# EAGLE design MO1 (EAGLE 7.4.0)
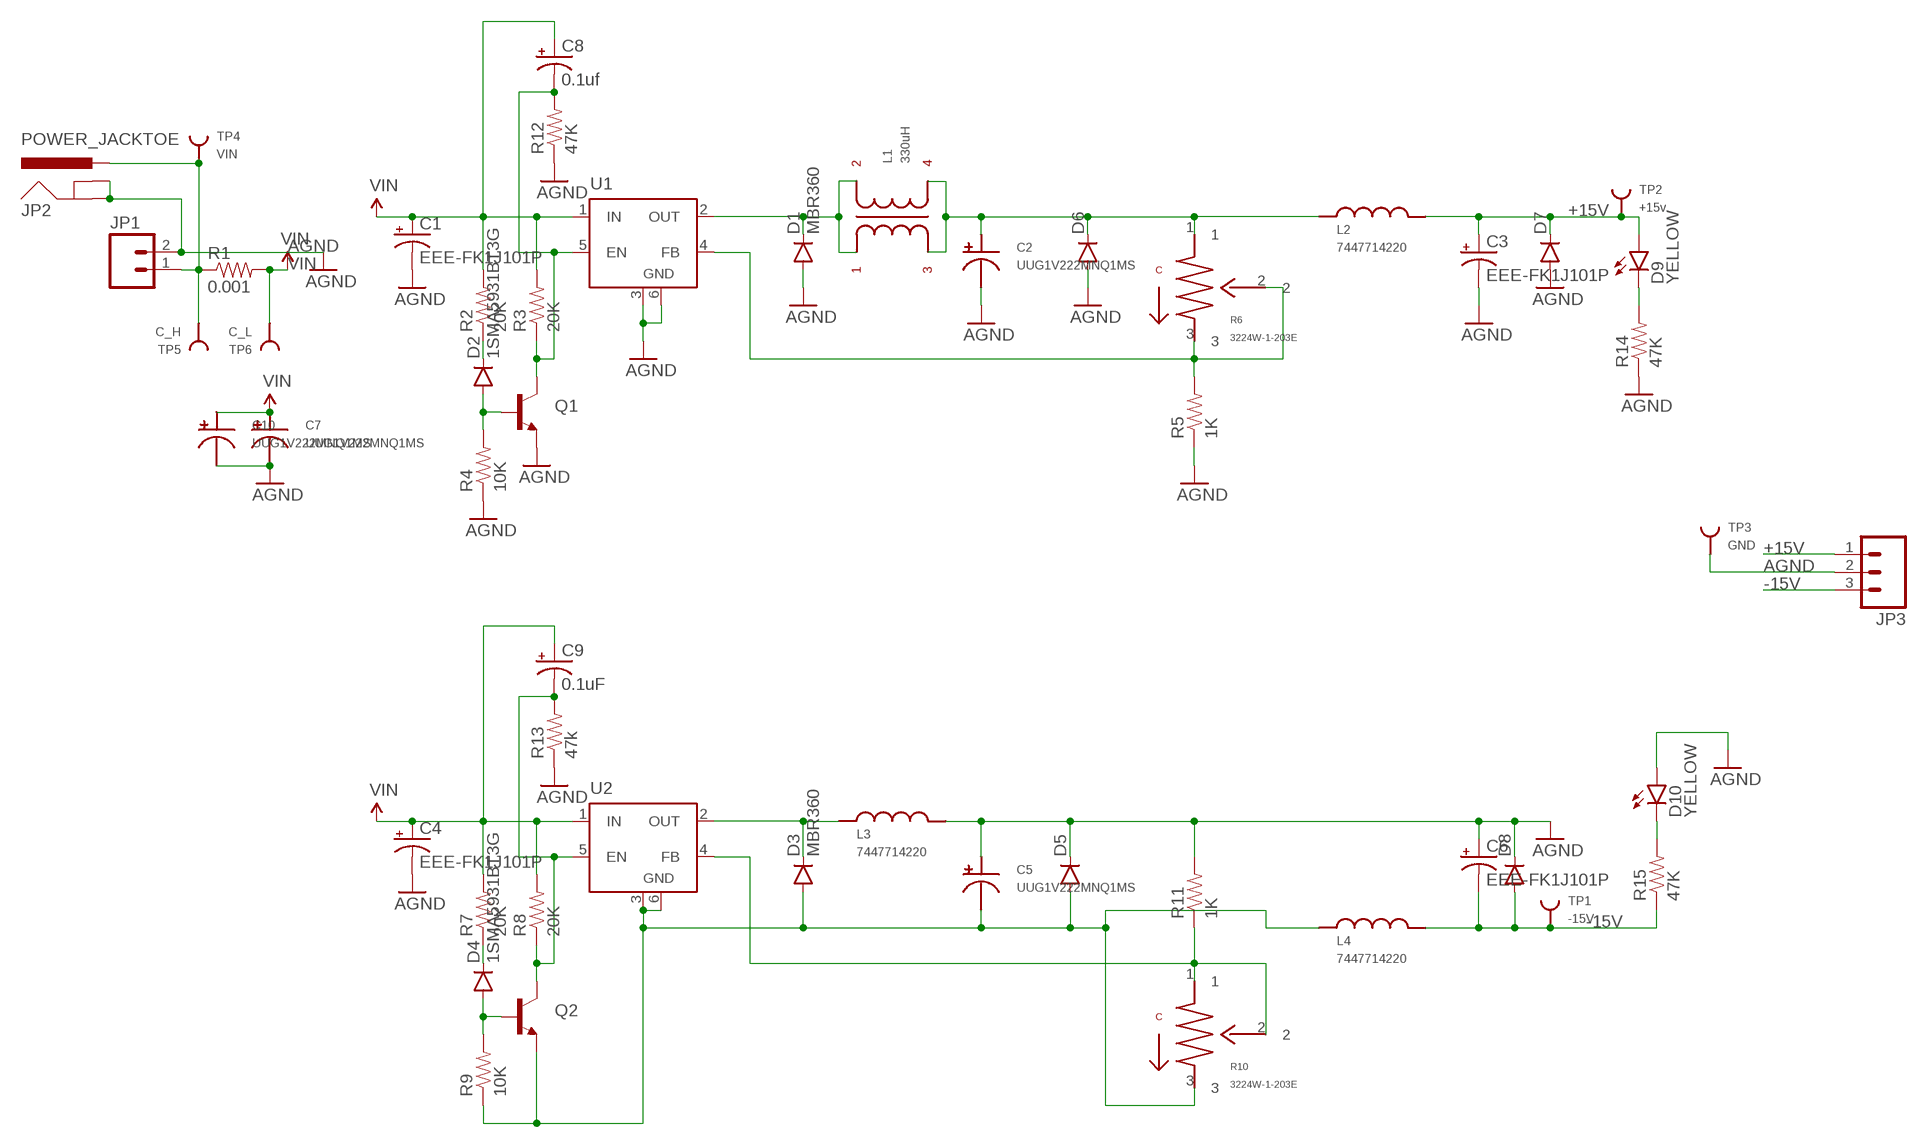
[diagram p0: schematic, sheet 1]

## Parts
C1  EEE-FK1J101P  CAP_POLG  [PANASONIC_G]
C2  UUG1V222MNQ1MS  [POL_18X21.5]
C3  EEE-FK1J101P  CAP_POLG  [PANASONIC_G]
C4  EEE-FK1J101P  CAP_POLG  [PANASONIC_G]
C5  UUG1V222MNQ1MS  [POL_18X21.5]
C6  EEE-FK1J101P  CAP_POLG  [PANASONIC_G]
C7  UUG1V222MNQ1MS  [POL_18X21.5]
C8  0.1uf  CAP_POLC  [PANASONIC_C]
C9  0.1uF  CAP_POLC  [PANASONIC_C]
C10  UUG1V222MNQ1MS  [POL_18X21.5]
D1  MBR360  DIODESMB  [SMB-DIODE]
D2  1SMA5931BT3G  DIODESMA  [SMA-DIODE]
D3  MBR360  DIODESMB  [SMB-DIODE]
D4  1SMA5931BT3G  DIODESMA  [SMA-DIODE]
D5  DIODESMA  [SMA-DIODE]
D6  DIODESMA  [SMA-DIODE]
D7  DIODESMA  [SMA-DIODE]
D8  DIODESMA  [SMA-DIODE]
D9  YELLOW  LED-YELLOW1206  [LED-1206]
D10  YELLOW  LED-YELLOW1206  [LED-1206]
JP1  M023.5MM_LOCK  [SCREWTERMINAL-3.5MM-2_LOCK]
JP2  POWER_JACKTOE  [POWER_JACK_SMD_OVERPASTE_TOE]
JP3  M03SCREW_LOCK  [SCREWTERMINAL-3.5MM-3_LOCK.007S]
L1  330uH  DRQ127-331-R  [DRQ127]
L2  7447714220  [INDUCTOR_10X10]
L3  7447714220  [INDUCTOR_10X10]
L4  7447714220  [INDUCTOR_10X10]
Q1  TRANSISTOR_NPNSOT23-3  [SOT23-3]
Q2  TRANSISTOR_NPNSOT23-3  [SOT23-3]
R1  0.001  0.001OHM-3W-1%(2512)3W/1%  [2512]
R2  20K  1.8KOHM1/10W1%(0603)  [0603-RES]
R3  20K  1.8KOHM1/10W1%(0603)  [0603-RES]
R4  10K  1.8KOHM1/10W1%(0603)  [0603-RES]
R5  1K  0.75OHM-1/4W-1%(0805)  [0805]
R6  3224W-1-203E  [3224W]
R7  20K  1.8KOHM1/10W1%(0603)  [0603-RES]
R8  20K  1.8KOHM1/10W1%(0603)  [0603-RES]
R9  10K  1.8KOHM1/10W1%(0603)  [0603-RES]
R10  3224W-1-203E  [3224W]
R11  1K  0.75OHM-1/4W-1%(0805)  [0805]
R12  47K  1.8KOHM1/10W1%(0603)  [0603-RES]
R13  47k  1.8KOHM1/10W1%(0603)  [0603-RES]
R14  47K  1.8KOHM1/10W1%(0603)  [0603-RES]
R15  47K  1.8KOHM1/10W1%(0603)  [0603-RES]
TP1  -15V  TP  [TP]
TP2  +15v  TP  [TP]
TP3  GND  TP  [TP]
TP4  VIN  TP  [TP]
TP5  C_H  TP  [TP]
TP6  C_L  TP  [TP]
U1  LM2596S  [TO263-5]
U2  LM2596S  [TO263-5]

## Nets
+15V: C3.+ D7.C D9.A JP3.1 L2.2 TP2.P$1(TP)
-15V: C6.- D8.A JP3.3 L4.2 R15.1 TP1.P$1(TP)
AGND: C1.- C2.NEGATIVE C3.- C4.- C5.POSITIVE C6.+ C7.NEGATIVE C10.NEGATIVE D1.A D5.C D6.A D7.A D8.C D10.A JP1.2 JP2.GND(GNDBREAK) JP2.P$4(GND) JP3.2 L3.2 Q1.2(E) R4.1 R5.1 R11.2 R12.1 R13.1 R14.1 TP3.P$1(TP) U1.3(GND) U1.6(GND)
N$1: JP1.1 JP2.VIN0(PWR) R1.1 TP4.P$1(TP) TP5.P$1(TP)
N$2: C2.POSITIVE D6.C L1.3 L1.4 L2.1 R6.1
N$3: D1.C L1.1 L1.2 U1.2(OUT)
N$4: D2.C R2.1
N$5: D2.A Q1.1(B) R4.2
N$6: D9.C R14.2
N$7: R5.2 R6.2 R6.3 U1.4(FB)
N$8: D3.C L3.1 U2.2(OUT)
N$9: C5.NEGATIVE D3.A D5.A L4.1 Q2.2(E) R9.1 R10.3 U2.3(GND) U2.6(GND)
N$10: D4.C R7.1
N$11: D4.A Q2.1(B) R9.2
N$12: D10.C R15.2
N$14: R10.1 R10.2 R11.1 U2.4(FB)
N$15: C8.- Q1.3(C) R3.1 R12.2 U1.5(EN)
N$16: C9.- Q2.3(C) R8.1 R13.2 U2.5(EN)
VIN: C1.+ C4.+ C7.POSITIVE C8.+ C9.+ C10.POSITIVE R1.2 R2.2 R3.2 R7.2 R8.2 TP6.P$1(TP) U1.1(IN) U2.1(IN)

## Library data of the parts
C1 C3 C4 C6 C8 C9 = SparkFun-Capacitors:CAP_POL: Capacitor Polarized These are standard SMD and PTH capacitors. Normally 10uF, 47uF, and 100uF in electrolytic and tantalum varieties. Always verify the external diameter of the through hole cap, it varies with capacity, voltage, and manufacturer. The EIA devices should be standard.
C2 C5 C7 C10 = MO1:UUG1V222MNQ1MS
D1 D3 = SparkFun-DiscreteSemi:DIODE: Diode These are standard reverse protection diodes and small signal diodes. SMA package can handle up to about 1A. SOD-323 can handle about 200mA. What the SOD-323 package when ordering, there are some mfgs out there that are 5-pin packages.; PROD_ID: DIO-09646
D2 D4-D8 = SparkFun-DiscreteSemi:DIODE: Diode These are standard reverse protection diodes and small signal diodes. SMA package can handle up to about 1A. SOD-323 can handle about 200mA. What the SOD-323 package when ordering, there are some mfgs out there that are 5-pin packages.
D9 D10 = SparkFun-LED:LED-YELLOW: Yellow SMD LEDs LilyPad 1206- DIO-09909 0603- DIO-09003 "SMART" means more efficient and expensive; PROD_ID: DIO-00820
JP1 = SparkFun-Connectors:M02: Standard 2-pin 0.1" header. Use with - straight break away headers ( PRT-00116) - right angle break away headers (PRT-00553) - swiss pins (PRT-00743) - machine pins (PRT-00117) - female headers (PRT-00115) Molex polarized connector foot print use with: PRT-08233 with associated crimp pins and housings. 2.54_SCREWTERM for use with PRT-10571. 3.5mm Screw Terminal footprints for PRT-08084 5mm Screw Terminal footprints for use with PRT-08432; PROD_ID: CONN-08399
JP2 = SparkFun-Connectors:POWER_JACK: Power Jack This is the standard 5.5mm barrel jack for power. The PTH is the most common, proven, reliable, footprint. The Slot footprint only works if the mill layer is transmitted to the PCB fab house so be warned. Mating wall wart : TOL-00298 (and others); PROD_ID: CONN-08106; SF_ID: PRT-12748
JP3 = SparkFun-Connectors:M03: Header 3 Standard 3-pin 0.1" header. Use with straight break away headers (SKU : PRT-00116), right angle break away headers (PRT-00553), swiss pins (PRT-00743), machine pins (PRT-00117), and female headers (PRT-00115). Molex polarized connector foot print use with SKU : PRT-08232 with associated crimp pins and housings.; PROD_ID: CONN-08288
L1 = MO1:DRQ127-331-R
L2-L4 = MO1:7447714220
Q1 Q2 = SparkFun-DiscreteSemi:TRANSISTOR_NPN: Generic NPN BJT MMBT2222A - TRANS-08049 (SOT-23, 1A 40V) MPSA42 - TRANS-09116 (SOT-23, 500mA 300V) MMBT5088LT1G - TRANS-11160 (SOT-23, 50 mA 30V) BC547 - COM-08928 <http://www.sparkfun.com/products/8928> (TO-92 45V 100mA) (1.Collector 2.Base 3.Emitter) 2N3904 - COM-00521 <http://www.sparkfun.com/products/521> (TO-92 40V 200mA) (1.Emitter 2.Base 3.Collector) P2N2222A - COM-12852 <http://www.sparkfun.com/products/12852> (TO-92 40V 600mA) (1.Collector 2.Base 3.Emitter); PROD_ID: TRANS-08049
R1 = SparkFun-Resistors:0.001OHM-3W-1%(2512); PROD_ID: RES-12449
R2-R4 R7-R9 R12-R15 = SparkFun-Resistors:1.8KOHM1/10W1%(0603): RES-09119; PROD_ID: RES-09119; VALUE: 1.8k
R5 R11 = SparkFun-Resistors:0.75OHM-1/4W-1%(0805): RES-08474; PROD_ID: RES-08474; VALUE: 0.75
R6 R10 = MO1:3224W-1-203E
TP1-TP6 = MO1:TP
U1 U2 = linear:LM2596S: STEP-DOWN VOLTAGE REGULATOR

## Board
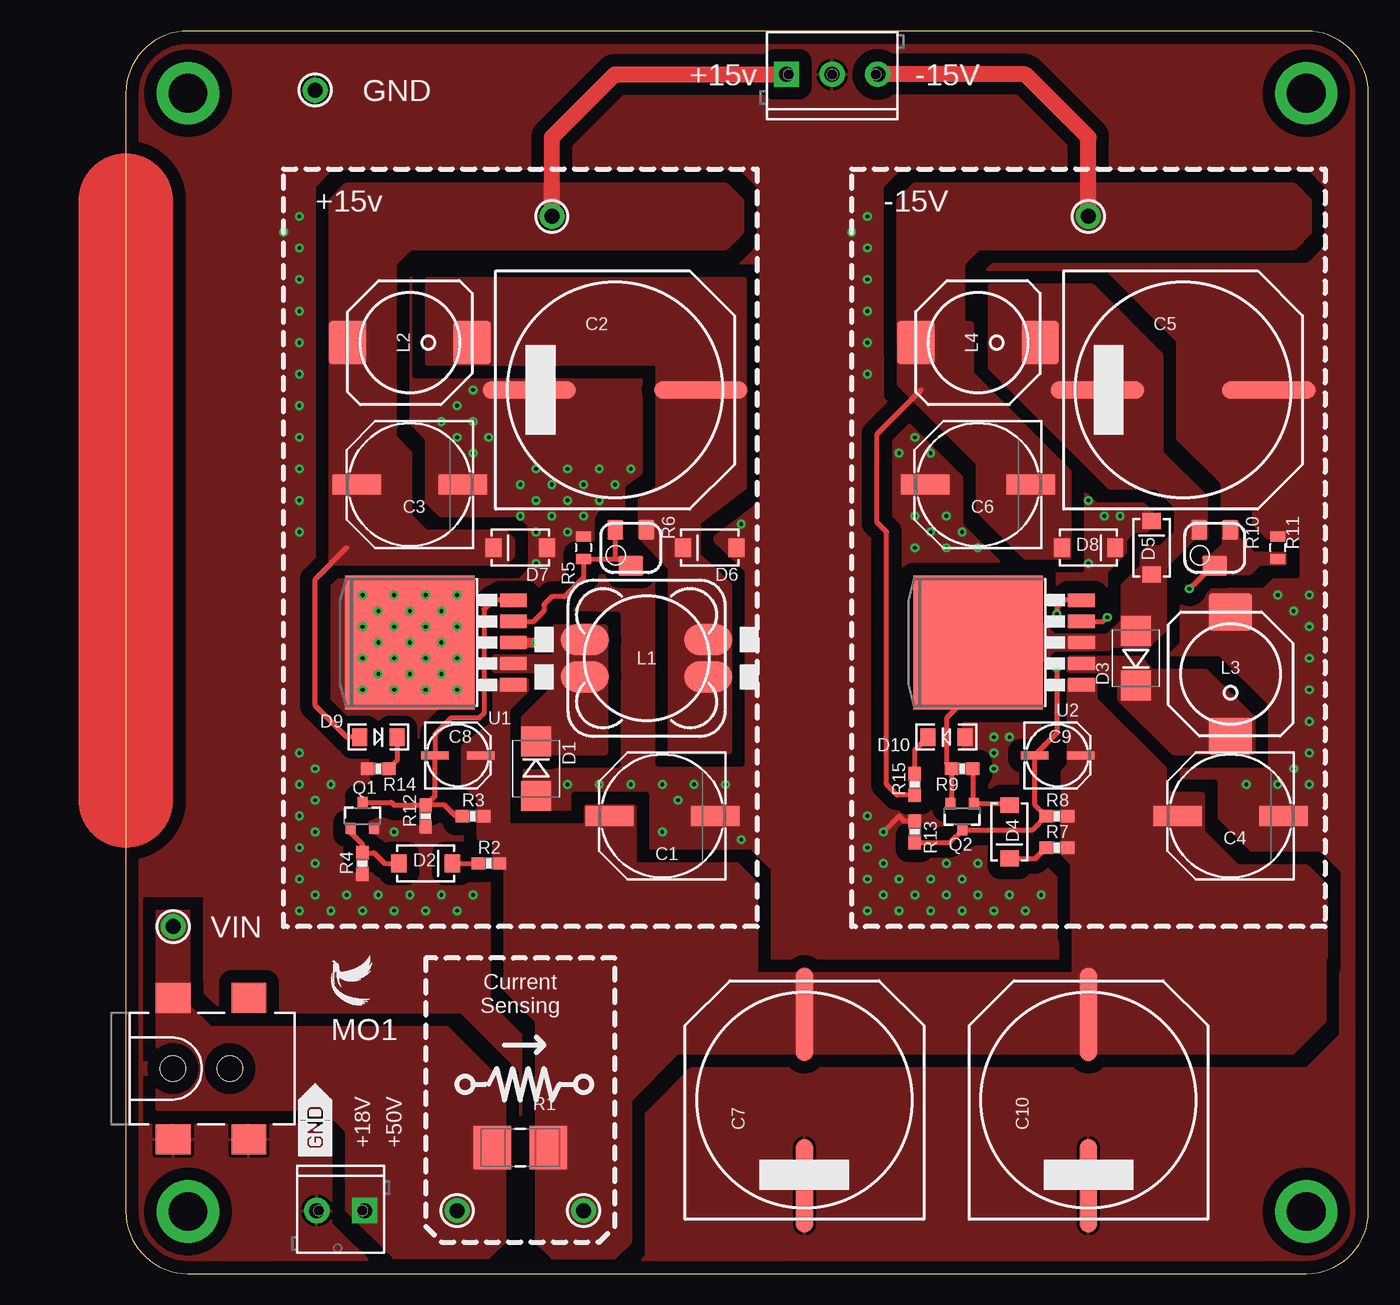
[diagram p1: board, top side]
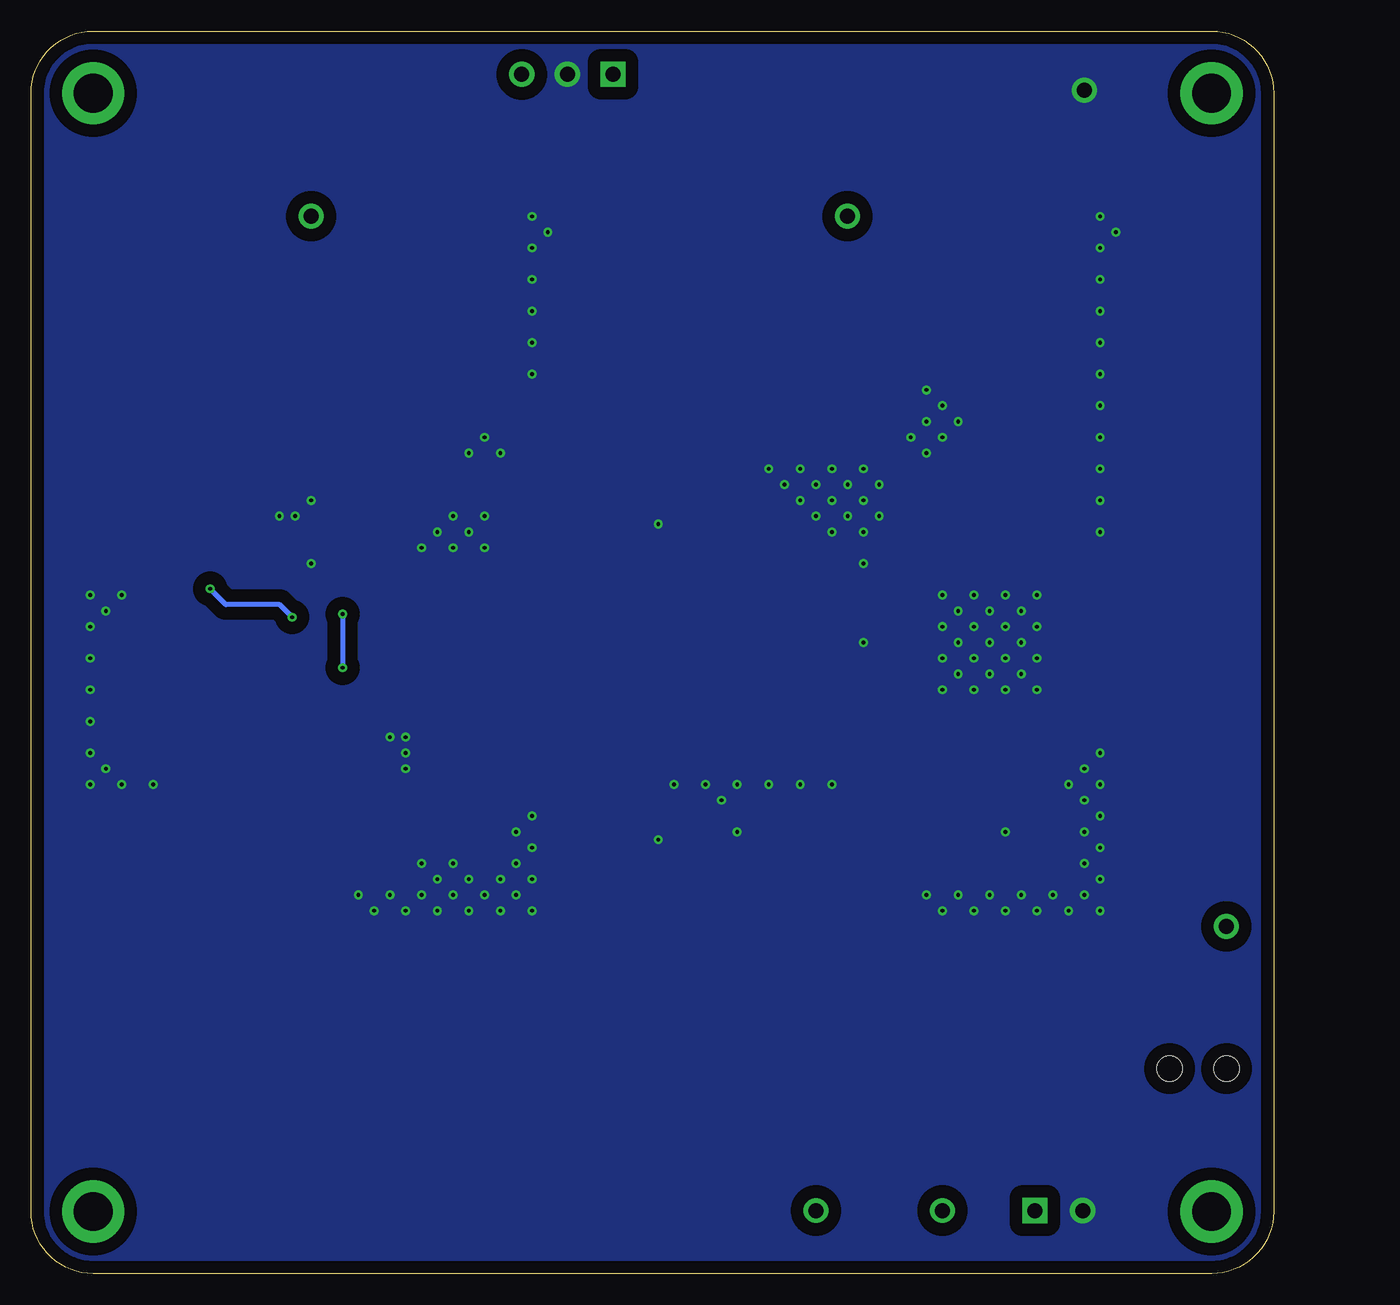
[diagram p2: board, bottom side, seen from below]

Size 100 x 100 mm. Coordinates in mm from the lower left corner, seen from the top.
Outline: 0,95 0,5 arc90 5,0 95,0 arc90 100,5 100,95 arc90 95,100 5,100 arc90 0,95
Copper layers (1*16): Top 0.035mm / dielectric 1.5mm / Bottom 0.035mm
Design rules "default *": minimum track width 8mil, minimum drill 12mil, track to track 6mil, track to pad 6mil, pad to pad 6mil, via to via 6mil, smd to smd 6mil, copper to edge 40mil, drill to drill 8mil, minimum pad ring 10mil, minimum via ring 8mil, stop-mask expansion 4mil, vias tented up to drill 24mil, thermal gap 10mil

### Footprints (pad centres in the part's own frame; a part is rotated, then mirrored left to right if it is on the bottom)
PANASONIC_G = smd 3.9 x 1.6: + 4.25,0; - -4.25,0
POL_18X21.5 = smd 1.4 x 7.5: NEGATIVE 0,-6.9; POSITIVE 0,6.9
PANASONIC_C = smd 2.2 x 0.65: + 1.9,-0.2; - -1.8,-0.2
SMB-DIODE = smd 2.4 x 2.4: A 2.2,0; C -2.2,0
SMA-DIODE = smd 1.27 x 1.47: A -2.15,0; C 2.15,0
LED-1206 = smd 1.2 x 1.4: A -1.5,0; C 1.5,0
SCREWTERMINAL-3.5MM-2_LOCK = drill 1.2 pad 2.032 square: 1 -0.178,0 | drill 1.2 pad 2.032: 2 3.678,0
POWER_JACK_SMD_OVERPASTE_TOE = smd 2.8 x 2.4: GND 0,-5.7; P$4 6.1,-5.7; VIN0 0,5.7; VIN1 6.1,5.7 | hole 2.032: 0,0; 4.572,0
SCREWTERMINAL-3.5MM-3_LOCK.007S = drill 1.2 pad 2.032 square: 1 -0.178,0 | drill 1.2 pad 2.032: 2 3.5,0; 3 7.178,0
DRQ127 = smd 3.85 x 2.5: 1 -4.975,1.5; 2 -4.975,-1.5; 3 4.975,-1.5; 4 4.975,1.5
INDUCTOR_10X10 = smd 3.5 x 3: 1 0,5; 2 0,-5
SOT23-3 = smd 0.8 x 0.9: 1 -0.95,-1; 2 0.95,-1; 3 0,1.1
2512 = smd 3 x 3.5: 1 -2.25,0; 2 2.25,0
0603-RES = smd 1.1 x 1: 1 -0.85,0; 2 0.85,0
0805 = smd 0.8 x 1.2: 1 -0.9,0; 2 0.9,0
3224W = smd 1.6 x 1.3: 1 -1.45,1.25; 3 -1.45,-1.25 | smd 1.6 x 2: 2 1.45,0
TP = drill 1.2 pad 2: P$1 0,0
TO263-5 = smd 1.067 x 2.159: 1 -3.404,-5.791; 2 -1.702,-5.791; 3 0,-5.791; 4 1.702,-5.791; 5 3.404,-5.791 | smd 10.8 x 10.41: 6 0,2.54

### Placement (x,y rotation side)
C1  43.18,36.83 180 top
C2  39.37,71.12 270 top
C3  22.86,63.5 180 top
C4  88.9,36.83 180 top
C5  85.09,71.12 270 top
C6  68.58,63.5 180 top
C7  54.61,13.97 0 top
C8  26.67,41.91 0 top
C9  74.93,41.91 0 top
C10  77.47,13.97 0 top
D1  33.02,40.64 270 top
D2  24.13,33.02 0 top
D3  81.28,49.53 90 top
D4  71.12,35.56 270 top
D5  82.55,58.42 90 top
D6  46.99,58.42 180 top
D7  31.75,58.42 180 top
D8  77.47,58.42 0 top
D9  20.32,43.18 0 top
D10  66.04,43.18 180 top
JP1  19.05,5.08 180 top
JP2  3.81,16.51 0 top
JP3  53.34,96.52 0 top
L1  41.91,49.53 0 top
L2  22.86,74.93 270 top
L3  88.9,48.26 180 top
L4  68.58,74.93 270 top
Q1  19.05,36.83 0 top
Q2  67.31,36.83 180 top
R1  31.75,10.16 0 top
R2  29.21,33.02 0 top
R3  27.94,36.83 0 top
R4  19.05,33.02 90 top
R5  36.83,58.42 270 top
R6  40.64,58.42 270 top
R7  74.93,34.29 0 top
R8  74.93,36.83 0 top
R9  67.31,40.64 0 top
R10  87.63,58.42 270 top
R11  92.71,58.42 90 top
R12  24.13,36.83 90 top
R13  63.5,35.56 270 top
R14  20.32,40.64 0 top
R15  63.5,39.37 90 top
TP1  77.47,85.09 0 top
TP2  34.29,85.09 0 top
TP3  15.24,95.25 0 top
TP4  3.81,27.94 0 top
TP5  26.67,5.08 0 top
TP6  36.83,5.08 0 top
U1  25.4,50.8 90 top
U2  71.12,50.8 90 top
U$19  [LOGO]  16.51,21.59 0 top

### Tracks (layer width: path | path; a pad name or v marks a point on that pad's centre or on a via)
+15V
  Top 0.406: D9.A 17.78,43.18 15.24,45.72 15.24,55.88 17.78,58.42
  Top 1.27: TP2.P$1 34.29,91.44 39.37,96.52 JP3.1
  pour Top (no thermals): 16.51,80.01 21.59,80.01 21.59,67.31 22.86,66.04 22.86,60.96 24.13,59.69 30.48,59.69 31.11,59.05 31.11,57.78 30.48,57.15 16.51,57.15
  pour Top: 16.51,80.01 16.51,86.36 17.78,87.63 48.26,87.63 49.53,86.36 49.53,83.82 48.26,82.55 22.86,82.55 21.59,81.28 21.59,80.01
-15V
  Top 0.406: R15.1 62.06,38.52 61.21,39.37 61.21,59.69 60.45,60.45 60.45,67.56 64.01,71.12
  Top 1.27: TP1.P$1 77.47,91.44 72.39,96.52 JP3.3
  pour Top (no thermals): 62.23,76.45 62.23,71.63 68.58,65.28 68.58,61.47 72.39,57.66 75.95,57.66 75.95,64.52 68.07,72.39 68.07,76.45
  pour Top (no thermals): 62.23,74.93 62.23,86.36 63.5,87.63 93.98,87.63 95.25,86.36 95.25,83.82 93.98,82.55 68.58,82.55 67.31,81.28 67.31,74.93
AGND  (via drill 0.3)
  Top 0.406: R13.1 62.65,36.41 62.23,36.83 v60.96,35.56
  Top 0.813: U1.3 v33.02,50.8
  other vias: 13.97,85.09 12.7,83.82 13.97,82.55 59.69,82.55 59.69,85.09 58.42,83.82 59.69,80.01 59.69,77.47 59.69,74.93 59.69,72.39 13.97,80.01 13.97,77.47 13.97,74.93 13.97,72.39 13.97,69.85 13.97,67.31 13.97,64.77 13.97,62.23 13.97,59.69 19.05,54.61 20.32,53.34 21.59,54.61 24.13,54.61 26.67,54.61 25.4,53.34 22.86,53.34 19.05,52.07 21.59,52.07 24.13,52.07 26.67,52.07 13.97,41.91 13.97,39.37 15.24,40.64 16.51,39.37 15.24,38.1 13.97,36.83 15.24,35.56 13.97,34.29 15.24,33.02 13.97,31.75 15.24,30.48 13.97,29.21 16.51,29.21 19.05,29.21 21.59,29.21 24.13,29.21 26.67,29.21 17.78,30.48 20.32,30.48 22.86,30.48 25.4,30.48 27.94,30.48 21.59,35.56 20.32,50.8 25.4,50.8 22.86,50.8 19.05,49.53 20.32,48.26 21.59,49.53 24.13,49.53 26.67,49.53 25.4,48.26 22.86,48.26 19.05,46.99 21.59,46.99 24.13,46.99 26.67,46.99 35.56,59.69 34.29,60.96 33.02,59.69 36.83,60.96 35.56,62.23 38.1,62.23 39.37,63.5 40.64,64.77 38.1,64.77 35.56,64.77 33.02,64.77 36.83,63.5 34.29,63.5 33.02,62.23 31.75,63.5 31.75,60.96 33.02,57.15 27.94,71.12 26.67,69.85 27.94,68.58 26.67,67.31 27.94,66.04 25.4,68.58 29.21,67.31 35.56,39.37 38.1,39.37 40.64,39.37 43.18,39.37 45.72,39.37 48.26,39.37 44.45,38.1 43.18,35.56 49.53,34.92 49.53,60.33 63.5,67.31 62.23,66.04 64.77,66.04 63.5,60.96 63.5,58.42 64.77,59.69 66.04,60.96 67.31,59.69 66.04,58.42 68.58,58.42 77.47,62.23 78.74,60.96 77.47,57.15 80.01,60.96 92.71,54.61 95.25,54.61 93.98,53.34 95.25,52.07 95.25,49.53 95.25,46.99 95.25,44.45 95.25,41.91 95.25,39.37 93.98,40.64 92.71,39.37 90.17,39.37 62.23,29.21 59.69,29.21 64.77,29.21 67.31,29.21 69.85,29.21 72.39,29.21 60.96,30.48 63.5,30.48 66.04,30.48 68.58,30.48 71.12,30.48 73.66,30.48 59.69,31.75 62.23,31.75 64.77,31.75 67.31,31.75 68.58,33.02 66.04,33.02 60.96,33.02 59.69,34.29 59.69,36.83 69.85,43.18 71.12,43.18 69.85,41.91 69.85,40.64
  pour Top (isolate 1.016, rank 2, no thermals): 12.7,86.36 50.8,86.36 50.8,27.94 12.7,27.94 12.7,81.28 10.16,81.28 10.16,83.82 12.7,83.82
  pour Bottom (isolate 1.016, rank 2, no thermals): 10.16,86.36 50.8,86.36 50.8,27.94 12.7,27.94 12.7,83.82 10.16,83.82
  pour Top (isolate 1.016, rank 2, no thermals): 55.88,83.82 58.42,83.82 58.42,86.36 96.52,86.36 96.52,27.94 58.42,27.94 58.42,81.28 55.88,81.28
  pour Bottom (isolate 1.016, rank 2, no thermals): 55.88,86.36 96.52,86.36 96.52,27.94 58.42,27.94 58.42,83.82 55.88,83.82
  pour Top (isolate 1.016, rank 6): -7.62,101.6 101.6,101.6 101.6,-2.54 -2.54,-2.54 -2.54,96.52 -7.62,96.52
  pour Bottom (isolate 1.016, rank 6, no thermals): -7.62,96.52 -2.54,96.52 -2.54,101.6 101.6,101.6 101.6,-2.54 -2.54,-2.54 -2.54,91.44 -7.62,91.44
N$1
  pour Top (rank 2, no thermals): 2.54,29.21 5.08,29.21 5.08,21.59 6.86,19.81 25.91,19.81 30.48,15.24 30.48,2.54 29.21,1.27 21.59,1.27 17.78,5.08 17.78,11.43 16,13.21 2.54,13.21
N$2
  pour Top (no thermals): 24.26,73.28 42.8,73.28 42.8,63.25 41.4,62.23 41.4,59.31 43.81,56.77 43.81,42.04 48.64,42.04 48.64,55.37 46.1,57.78 46.1,60.45 49.78,63.25 49.78,80.01 24.26,80.01
N$3
  pour Top (no thermals): 29.72,49.66 34.54,49.66 34.54,52.07 38.61,52.07 38.61,41.91 32,41.91 32,44.7 34.54,47.24 34.54,48.51 29.72,48.51
N$4
  Top 0.406: D2.C R2.1
N$5
  Top 0.406: Q1.1 18.1,35.49 19.05,34.54 R4.2 19.98,33.87 20.83,33.02 D2.A
N$6
  Top 0.406: D9.C 21.82,41.29 R14.2
N$7
  Top 0.406: 39.5,57.52 R5.2 36.83,56.01 35.31,54.48 34.29,54.48 33.66,53.85 33.66,53.34 32.77,52.45 31.24,52.45 U1.4 | 39.5,57.52 40.09,57.52 R6.2 | R6.3 39.39,57.63 39.5,57.52
N$8
  pour Top (no thermals): 75.95,49.53 81.53,49.53 82.55,48.51 86.87,48.51 90.68,44.7 90.68,41.91 84.33,41.91 80.01,46.23 80.01,47.24 78.74,48.51 75.95,48.51
N$9
  Top 0.406: U2.6 68.58,47.24 66.04,44.7 66.04,41.06 R9.1 66.46,37.93 Q2.2
  pour Top (no thermals): 69.6,79.5 77.72,79.5 83.31,73.91 83.31,66.04 86.87,62.48 86.87,59.18 85.85,59.18 83.57,56.9 83.57,51.82 82.3,50.55 79.25,50.55 78.99,50.29 75.95,50.29 75.95,51.31 78.99,51.31 80.26,52.58 80.26,52.83 80.26,55.37 81.79,56.9 81.79,57.91 82.3,58.42 83.31,58.42 84.58,59.69 84.58,61.72 83.06,63.25 79.25,63.25 69.6,72.9
  pour Top (no thermals): 77.72,51.31 74.68,51.31 73.66,52.32 73.66,49.28 74.68,50.29 77.72,50.29
N$10
  Top 0.406: D4.C 73.2,33.41 R7.1
N$11
  Top 0.406: R9.2 68.16,37.93 Q2.1 71,37.83 D4.A
N$12
  Top 0.406: R15.2 63.5,42.14 D10.C
N$13  (via drill 3.1 pad 5)
  other vias: 5,95
N$14  (via drill 0.3)
  Top 0.406: U2.4 78.66,52.5 v78.99,52.83 | v85.6,55.12 87.12,56.64 87.3,56.64 R10.2
  Bottom 0.406: v78.99,52.83 80.01,53.85 84.33,53.85 v85.6,55.12
  pour Top (no thermals): 86.87,57.66 87.38,57.66 88.39,58.67 88.39,60.45 89.41,60.45 89.41,59.18 90.68,57.91 93.22,57.91 93.22,57.15 91.19,57.15 90.42,56.39 86.87,56.39
N$15
  Top 0.406: U1.5 29.57,54.2 28.83,53.47 28.83,45.09 28.45,44.7 26.16,44.7 24.89,43.43 24.89,41.73 C8.- 24.87,38.42 R12.2 | R3.1 26.54,36.83 25.65,37.72 24.17,37.72 R12.2 | Q1.3 21.38,37.93 21.59,37.72 24.09,37.72 R12.2
N$16  (via drill 0.3)
  Top 0.406: U2.5 75.54,54.2 74.93,53.59 v74.93,53.09 | v74.93,48.77 74.93,43.51 C9.- 73.13,37.78 R8.1 72.98,35.73 Q2.3 66.29,34.71 R13.2
  Bottom 0.406: v74.93,53.09 v74.93,48.77
N$17  (via drill 3.1 pad 5)
  other vias: 95,95
N$18  (via drill 3.1 pad 5)
  other vias: 5,5
N$19  (via drill 3.1 pad 5)
  other vias: 95,5
N$20
  Top 7.62: 0,86.36 0,38.1
VIN
  pour Top (no thermals): 30.23,47.75 32.26,47.75 32.26,46.99 30.73,45.47 30.73,36.07 37.08,36.07 37.08,37.59 40.89,37.59 40.89,32.77 29.72,32.77 29.72,35.05 28.45,35.05 28.45,38.35 27.18,39.37 27.18,42.42 29.72,44.45 29.72,47.24
  pour Top (no thermals): 40.89,33.02 49.28,33.02 50.8,31.5 50.8,25.4 48.26,25.4 48.26,27.94 30.48,27.94 30.48,33.02 40.64,33.02
  pour Top (no thermals): 75.95,47.75 77.98,47.75 77.98,46.23 83.57,40.64 83.57,38.61 86.61,38.61 86.61,35.56 89.41,32.77 95,32.77 96.52,31.24 96.52,25.4 93.98,25.4 93.98,27.94 76.2,27.94 76.2,33.02 75.44,33.78 75.44,40.39 75.95,40.89
  pour Top (rank 2, no thermals): 30.48,27.94 30.48,22.86 33.02,20.32 33.02,2.54 34.29,1.27 39.37,1.27 40.64,2.54 40.64,13.97 44.45,17.78 93.98,17.78 96.52,20.32 96.52,27.94 76.2,27.94 76.2,24.13 50.8,24.13 50.8,27.94

### Text on the board
tNames: +15v | -15V | GND | +15v | -15V | VIN | Current | Sensing | MO1 | +18V | +50V